# Altium schematic sheet [10]Motor_Driver_2.SchDoc
size A3; DocumentNumber: 10; SheetNumber: 10; SheetTotal: 11
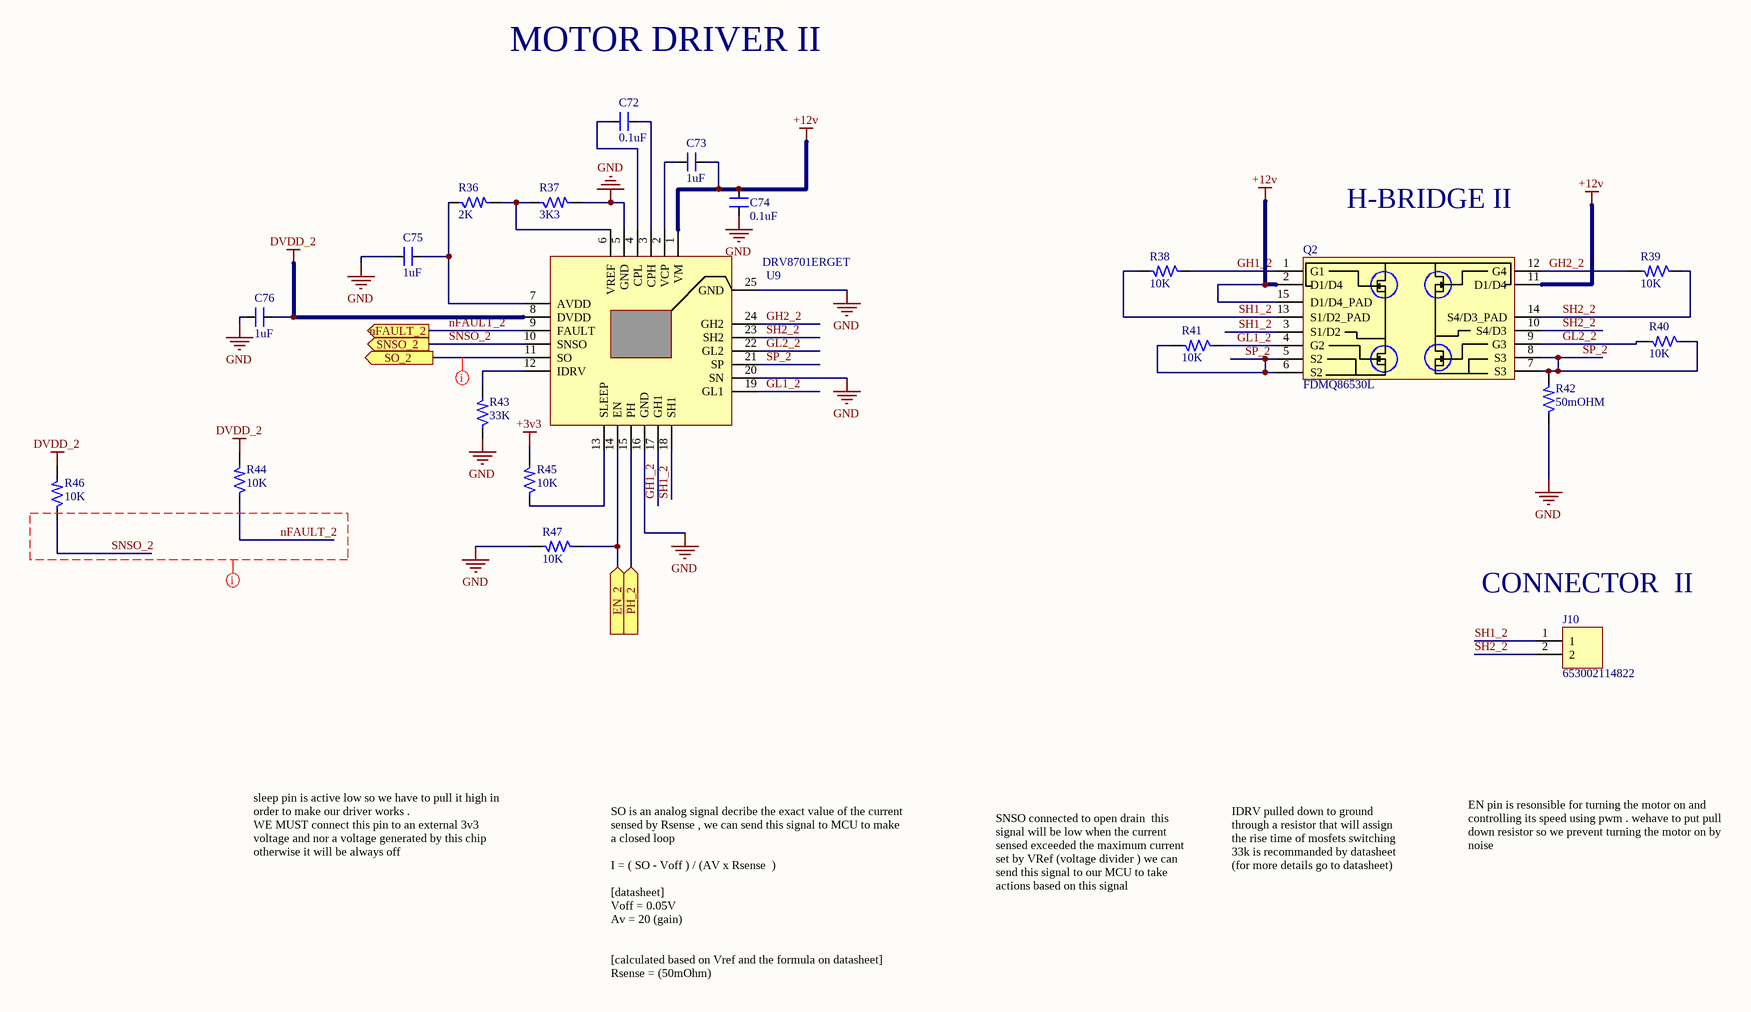
[diagram p0: [10]Motor_Driver_2.SchDoc]

## Parts
C72  0.1uF  [CAP_0805]
C73  1uF  [CAP_0805]
C74  0.1uF  [CAP_0805]
C75  1uF  [CAP_0805]
C76  1uF  [CAP_0805]
J10  653002114822  [CON2_50_653002114822_TH_ST]
Q2  FDMQ86530L  [DFN5045-12_33_212_27X15_SMD_1]
R36  2K  [RES_0805]
R37  3K3  [RES_0603]
R38  10K  [RES_0805]
R39  10K  [RES_0805]
R40  10K  [RES_0805]
R41  10K  [RES_0805]
R42  50mOHM  [RES_2512]
R43  33K  [RES_0805]
R44  10K  [RES_0805]
R45  10K  [RES_0805]
R46  10K  [RES_0805]
R47  10K  [RES_0805]
U9  DRV8701ERGET  [VFQFN24_19.6_196_12X32_SMD_1]

## Ports
EN_2 (in), nFAULT_2 (out), PH_2 (in), SNSO_2 (out), SO_2 (out)

## Nets
+3v3: R45.2
+12v: C73.2 C74.2 Q2.2(D1/D4) Q2.11(D1/D4) Q2.15(D1/D4_PAD) U9.1(VM)
DVDD_2: C76.2 R44.2 R46.2 U9.8(DVDD)
GND: C74.1 C75.1 C76.1 R37.2 R42.1 R43.1 R47.2 U9.5(GND) U9.16(GND) U9.20(SN) U9.25(GND)
EN_2: R47.1 U9.14(EN) ; port EN_2
GH1_2: Q2.1(G1) R38.1 U9.17(GH1)
GH2_2: Q2.12(G4) R39.2 U9.24(GH2)
GL1_2: Q2.4(G2) R41.1 U9.19(GL1)
GL2_2: Q2.9(G3) R40.2 U9.22(GL2)
nFAULT_2: R44.1 U9.9(FAULT) ; port nFAULT_2
PH_2: U9.15(PH) ; port PH_2
SH1_2: J10.1 Q2.3(S1/D2) Q2.13(S1/D2_PAD) R38.2 U9.18(SH1)
SH2_2: J10.2 Q2.10(S4/D3) Q2.14(S4/D3_PAD) R39.1 U9.23(SH2)
SNSO_2: R46.1 U9.10(SNSO) ; port SNSO_2
SO_2: U9.11(SO) ; port SO_2
SP_2: Q2.5(S2) Q2.6(S2) Q2.7(S3) Q2.8(S3) R40.1 R41.2 R42.2 U9.21(SP)
NetC72_1: C72.1 U9.4(CPL)
NetC72_2: C72.2 U9.3(CPH)
NetC73_1: C73.1 U9.2(VCP)
NetC75_2: C75.2 R36.1 U9.7(AVDD)
NetR36_2: R36.2 R37.1 U9.6(VREF)
NetR43_2: R43.2 U9.12(IDRV)
NetR45_1: R45.1 U9.13(SLEEP)

## Layout directives
net class Critical nets: nFAULT_2, SNSO_2, SO_2

## Notes on the sheet
- MOTOR DRIVER II
- H-BRIDGE II
- (near J10) CONNECTOR  II
- sleep pin is active low so we have to pull it high in order to make our driver works .
  WE MUST connect this pin to an external 3v3 voltage and nor a voltage generated by this chip otherwise it will be always off
- SNSO connected to open drain  this signal will be low when the current sensed exceeded the maximum current set by VRef (voltage divider ) we can send this signal to our MCU to take actions based on this signal
- IDRV pulled down to ground through a resistor that will assign the rise time of mosfets switching
  33k is recommanded by datasheet
  (for more details go to datasheet)
- EN pin is resonsible for turning the motor on and controlling its speed using pwm . wehave to put pull down resistor so we prevent turning the motor on by noise
- SO is an analog signal decribe the exact value of the current  sensed by Rsense , we can send this signal to MCU to make a closed loop
  I = ( SO - Voff ) / (AV x Rsense  )
  [datasheet]
  Voff = 0.05V
  Av = 20 (gain)
  [calculated based on Vref and the formula on datasheet]
  Rsense = (50mOhm)
- Title
- Size:
- Date:
- A3
- Number:
- Time:
- Revision:
- Sheet
- of
- File:

## Library data of the parts
C72 C74 = CAP_0.1uF-50V-5%-0805: 0.1µF ±5% 50V Ceramic Capacitor X7R 0805 (2012 Metric) /; Manufacturer: AVX Corporation; Manufacturer Part Number: 08055C104JAT4A; Alternate Part Number-1: 0805B104M500; Case/Package: 0805; Supplier-1: SIRICOM; Supplier Part Number-1: 0805B104J500CT
C73 C75 C76 = CAP_1uF-50V-5%-0805: 1µF ±5% 50V Ceramic Capacitor X7R 0805 (2012 Metric) /; Manufacturer: Samsung; Manufacturer Part Number: CC0805JKX7R9BB105; Alternate Part Number-1: 0805F105M500NT; Case/Package: 0805; Supplier-1: SIRICOM; Supplier Part Number-1: CL21B105KBFNNNE
J10 = CON-PLG_2X1-50-ST-TH: 2 Pins, 1 Row 1.25mm Pitch, Straight Connector, male; Manufacturer: JST; Mating Part Number: 653002113322; Crimp Part Number: 653153128130; Alternate Part Number-1: NA; Manufacturer Part Number: 653002114822; Case/Package: TH-CON; Supplier-1: WURTH; Supplier Part Number-1: 653002114822
Q2 = MOSFET-N_60V-8A-V-DFN5045-12: Mosfet Array 4 N-Channel 8A (Ta) Surface Mount V-DFN5045-12; Manufacturer: ON Semiconductor; Alternate Part Number-1: NA; Manufacturer Part Number: FDMQ86530L; Case/Package: DFN5045-12; Supplier-1: Arrow; Supplier Part Number-1: FDMQ86530L
R36 = RES_2K-0.125W-1%-0805: 2 kOhms ±1% 0.125W, 1/8W Chip Resistor 0805 (2012 Metric) Moisture Resistant Thick Film /; Manufacturer: TE Connectivity; Manufacturer Part Number: RC0805FR-072KL; Alternate Part Number-1: NA; Case/Package: 0805; Supplier-1: SIRICOM; Supplier Part Number-1: WR08X2001FTL
R37 = RES_3.3K-0.1W-1%-0603: 3.3 kOhms ±1% 0.1W, 1/10W Chip Resistor 0603 (1608 Metric) Automotive AEC-Q200 Thick Film /; Manufacturer: Wilson; Manufacturer Part Number: WR06X3301FTL; Alternate Part Number-1: 0603WAF3301T5E; Case/Package: 0603; Supplier-1: SIRICOM; Supplier Part Number-1: WR06X3301FTL
R38-R41 R44-R47 = RES_10K-0.125W-1%-0805: 10 kOhms ±1% 0.125W, 1/8W Chip Resistor 0805 (2012 Metric) Automotive AEC-Q200 Thick Film /; Manufacturer: CTS; Manufacturer Part Number: WR08X1002FTL; Case/Package: 0805; Supplier-1: SIRICOM; Supplier Part Number-1: WR08X1002FTL; Alternate Part Number-1: WR08X1002FTL
R42 = RES_50mOhm-2W-1%-2512: 50 mOhms ±1% 2W Chip Resistor 2512 (6432 Metric) Automotive AEC-Q200, Current Sense, Moisture Resistant Metal Element /; Manufacturer: Yageo; Manufacturer Part Number: PA2512FKF7W0R05E; Alternate Part Number-1: PMR100HZPFU5L00; Case/Package: 2512; Supplier-1: SIRICOM; Supplier Part Number-1: LR2512-22R060F1
R43 = RES_33K-0.125W-1%-0805: Thick Film Resistors - SMD 33KOhms 1/8W 150V33 kOhms ±1% 0.125W, 1/8W Chip Resistor 0805 (2012 Metric) Thick Film /; Manufacturer: Vishay BCcomponents; Manufacturer Part Number: CRG0805F33K; Alternate Part Number-1: NA; Case/Package: 0805; Supplier-1: SIRICOM; Supplier Part Number-1: WR08X3302FTL
U9 = IC_DRV8701ERGET: Motor Driver Power MOSFET Parallel 24-VQFN (4x4); Manufacturer: Texas Instruments; Alternate Part Number-1: NA; Manufacturer Part Number: DRV8701ERGET; Case/Package: VFQFN24; Supplier-1: ARROW; Supplier Part Number-1: DRV8701ERGET